# Altium schematic sheet Nav_Ducer_IO.SchDoc
size A
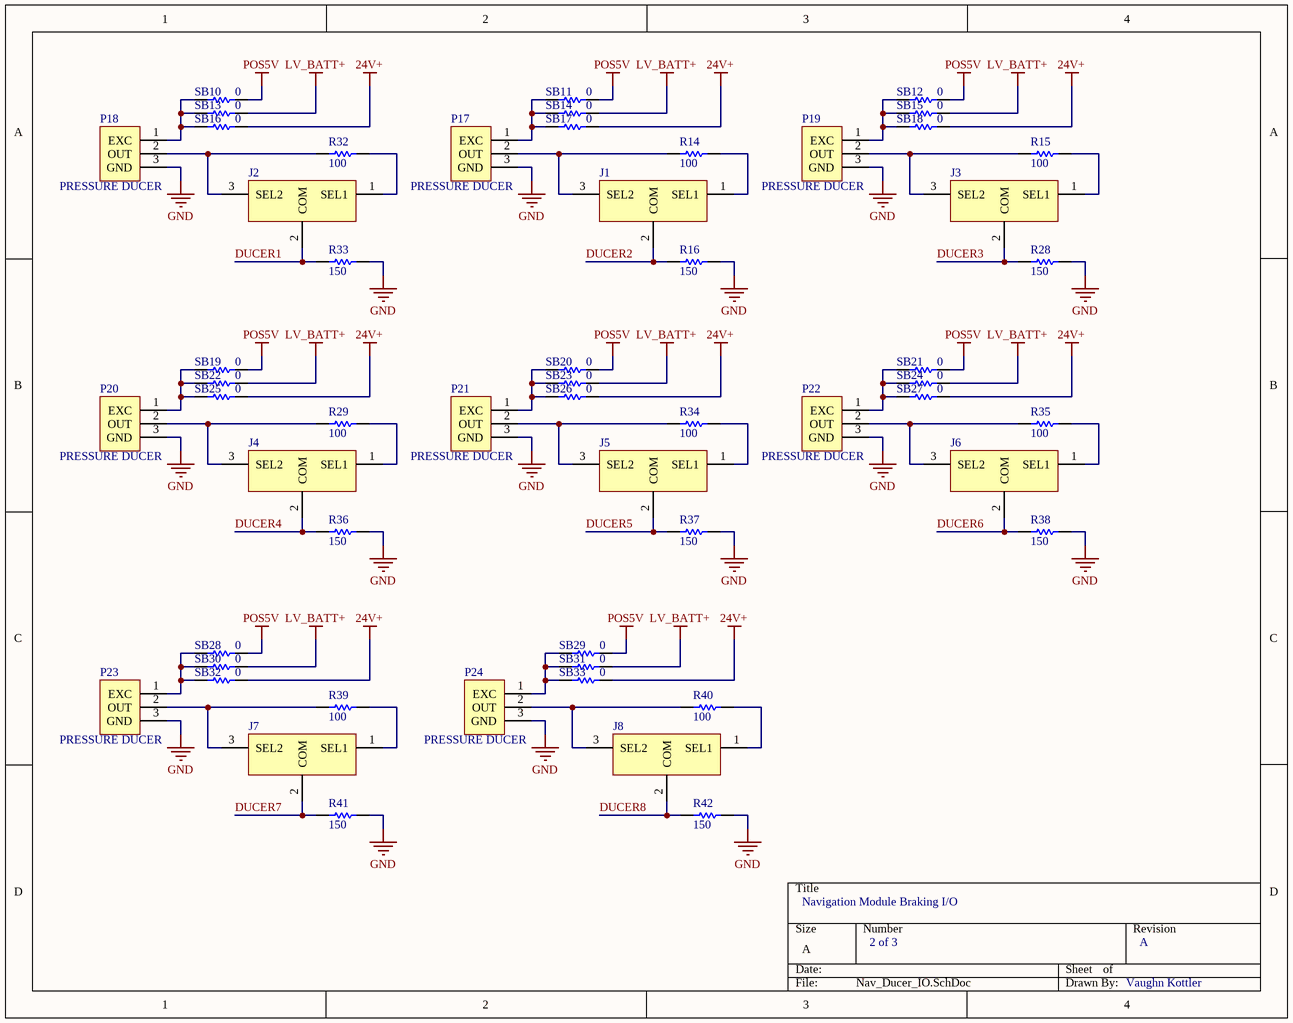
[diagram p0: Nav_Ducer_IO.SchDoc]

## Parts
J1  SINGLE_SEL  [SEL]  (value not drawn)
J2  SINGLE_SEL  [SEL]  (value not drawn)
J3  SINGLE_SEL  [SEL]  (value not drawn)
J4  SINGLE_SEL  [SEL]  (value not drawn)
J5  SINGLE_SEL  [SEL]  (value not drawn)
J6  SINGLE_SEL  [SEL]  (value not drawn)
J7  SINGLE_SEL  [SEL]  (value not drawn)
J8  SINGLE_SEL  [SEL]  (value not drawn)
P17  PRESSURE DUCER  [3POS TERM BLOCK]
P18  PRESSURE DUCER  [3POS TERM BLOCK]
P19  PRESSURE DUCER  [3POS TERM BLOCK]
P20  PRESSURE DUCER  [3POS TERM BLOCK]
P21  PRESSURE DUCER  [3POS TERM BLOCK]
P22  PRESSURE DUCER  [3POS TERM BLOCK]
P23  PRESSURE DUCER  [3POS TERM BLOCK]
P24  PRESSURE DUCER  [3POS TERM BLOCK]
R14  value 100  [6-0805_M]  (hidden comment: Res1)
R15  value 100  [6-0805_M]  (hidden comment: Res1)
R16  value 150  [6-0805_M]  (hidden comment: Res1)
R28  value 150  [6-0805_M]  (hidden comment: Res1)
R29  value 100  [6-0805_M]  (hidden comment: Res1)
R32  value 100  [6-0805_M]  (hidden comment: Res1)
R33  value 150  [6-0805_M]  (hidden comment: Res1)
R34  value 100  [6-0805_M]  (hidden comment: Res1)
R35  value 100  [6-0805_M]  (hidden comment: Res1)
R36  value 150  [6-0805_M]  (hidden comment: Res1)
R37  value 150  [6-0805_M]  (hidden comment: Res1)
R38  value 150  [6-0805_M]  (hidden comment: Res1)
R39  value 100  [6-0805_M]  (hidden comment: Res1)
R40  value 100  [6-0805_M]  (hidden comment: Res1)
R41  value 150  [6-0805_M]  (hidden comment: Res1)
R42  value 150  [6-0805_M]  (hidden comment: Res1)
SB10  value 0  [6-0805_M]  (hidden comment: Res1)
SB11  value 0  [6-0805_M]  (hidden comment: Res1)
SB12  value 0  [6-0805_M]  (hidden comment: Res1)
SB13  value 0  [6-0805_M]  (hidden comment: Res1)
SB14  value 0  [6-0805_M]  (hidden comment: Res1)
SB15  value 0  [6-0805_M]  (hidden comment: Res1)
SB16  value 0  [6-0805_M]  (hidden comment: Res1)
SB17  value 0  [6-0805_M]  (hidden comment: Res1)
SB18  value 0  [6-0805_M]  (hidden comment: Res1)
SB19  value 0  [6-0805_M]  (hidden comment: Res1)
SB20  value 0  [6-0805_M]  (hidden comment: Res1)
SB21  value 0  [6-0805_M]  (hidden comment: Res1)
SB22  value 0  [6-0805_M]  (hidden comment: Res1)
SB23  value 0  [6-0805_M]  (hidden comment: Res1)
SB24  value 0  [6-0805_M]  (hidden comment: Res1)
SB25  value 0  [6-0805_M]  (hidden comment: Res1)
SB26  value 0  [6-0805_M]  (hidden comment: Res1)
SB27  value 0  [6-0805_M]  (hidden comment: Res1)
SB28  value 0  [6-0805_M]  (hidden comment: Res1)
SB29  value 0  [6-0805_M]  (hidden comment: Res1)
SB30  value 0  [6-0805_M]  (hidden comment: Res1)
SB31  value 0  [6-0805_M]  (hidden comment: Res1)
SB32  value 0  [6-0805_M]  (hidden comment: Res1)
SB33  value 0  [6-0805_M]  (hidden comment: Res1)

## Nets
24V+: SB16.1 SB17.1 SB18.1 SB25.1 SB26.1 SB27.1 SB32.1 SB33.1
GND: P17.3(GND) P18.3(GND) P19.3(GND) P20.3(GND) P21.3(GND) P22.3(GND) P23.3(GND) P24.3(GND) R16.1 R28.1 R33.1 R36.1 R37.1 R38.1 R41.1 R42.1
LV_BATT+: SB13.1 SB14.1 SB15.1 SB22.1 SB23.1 SB24.1 SB30.1 SB31.1
POS5V: SB10.1 SB11.1 SB12.1 SB19.1 SB20.1 SB21.1 SB28.1 SB29.1
DUCER1: J2.2(COM) R33.2
DUCER2: J1.2(COM) R16.2
DUCER3: J3.2(COM) R28.2
DUCER4: J4.2(COM) R36.2
DUCER5: J5.2(COM) R37.2
DUCER6: J6.2(COM) R38.2
DUCER7: J7.2(COM) R41.2
DUCER8: J8.2(COM) R42.2
NetJ1_1: J1.1(SEL1) R14.1
NetJ1_3: J1.3(SEL2) P17.2(OUT) R14.2
NetJ2_1: J2.1(SEL1) R32.1
NetJ2_3: J2.3(SEL2) P18.2(OUT) R32.2
NetJ3_1: J3.1(SEL1) R15.1
NetJ3_3: J3.3(SEL2) P19.2(OUT) R15.2
NetJ4_1: J4.1(SEL1) R29.1
NetJ4_3: J4.3(SEL2) P20.2(OUT) R29.2
NetJ5_1: J5.1(SEL1) R34.1
NetJ5_3: J5.3(SEL2) P21.2(OUT) R34.2
NetJ6_1: J6.1(SEL1) R35.1
NetJ6_3: J6.3(SEL2) P22.2(OUT) R35.2
NetJ7_1: J7.1(SEL1) R39.1
NetJ7_3: J7.3(SEL2) P23.2(OUT) R39.2
NetJ8_1: J8.1(SEL1) R40.1
NetJ8_3: J8.3(SEL2) P24.2(OUT) R40.2
NetP17_1: P17.1(EXC) SB11.2 SB14.2 SB17.2
NetP18_1: P18.1(EXC) SB10.2 SB13.2 SB16.2
NetP19_1: P19.1(EXC) SB12.2 SB15.2 SB18.2
NetP20_1: P20.1(EXC) SB19.2 SB22.2 SB25.2
NetP21_1: P21.1(EXC) SB20.2 SB23.2 SB26.2
NetP22_1: P22.1(EXC) SB21.2 SB24.2 SB27.2
NetP23_1: P23.1(EXC) SB28.2 SB30.2 SB32.2
NetP24_1: P24.1(EXC) SB29.2 SB31.2 SB33.2

## Notes on the sheet
- Navigation Module Braking I/O
- 2 of 3
- A
- Vaughn Kottler

## Library data of the parts
R14-R16 R28 R29 R32-R42 SB10-SB33 = Res1: Resistor; Published: 8-Jun-2000; LatestRevisionDate: 17-Jul-2002; LatestRevisionNote: Re-released for DXP Platform.; PackageReference: AXIAL-0.3; Publisher: Altium Limited; PackageDescription: Axial Device, Thru-Hole; 2 Leads; 0.3 in Pin Spacing